# EAGLE schematic blinky-sch-done (EAGLE 7.3.0)
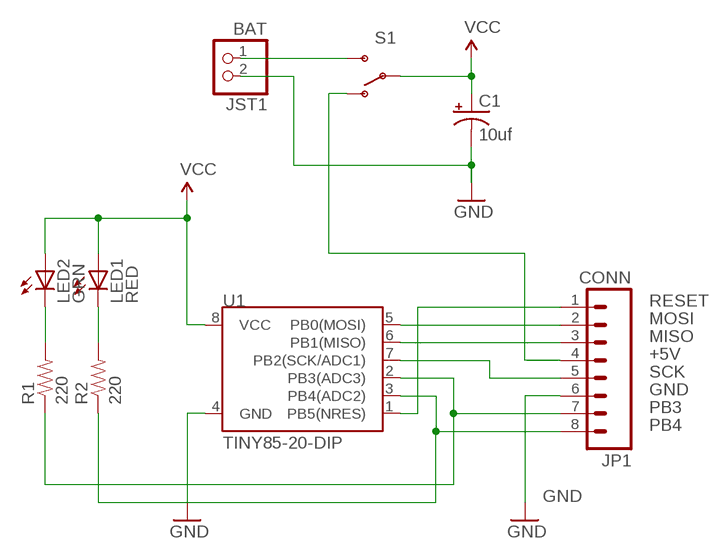
[diagram p0: schematic, sheet 1]

## Parts
C1  10uf  10UF-25V-20%(PTH)  [CPOL-RADIAL-10UF-25V]
JP1  CONN  M08LOCK  [1X08_LOCK]
JST1  BAT  JST_2PIN-THM-RA  [JST-PH-2-THM-RA]
LED1  RED  LED5MM  [LED5MM]
LED2  GRN  LED5MM  [LED5MM]
R1  220  RESISTORAXIAL-0.3  [AXIAL-0.3]
R2  220  RESISTORAXIAL-0.3  [AXIAL-0.3]
S1  SWITCH-SPDT  [SWITCH-SPDT_3.2MM]
U1  TINY85-20-DIP  ATTINY85TINY85-20-DIP  [DIP08]

## Nets
+5V: JP1.4 S1.1(O)
GND: C1.2(-) JP1.6 JST1.2 U1.4(GND)
MISO: JP1.3 U1.6(PB1(MISO))
MOSI: JP1.2 U1.5(PB0(MOSI))
N$1: JST1.1 S1.3(S)
N$4: LED2.K(C) R1.P$2
N$5: LED1.K(C) R2.P$2
PB3: JP1.7 R1.P$1 U1.2(PB3(ADC3))
PB4: JP1.8 R2.P$1 U1.3(PB4(ADC2))
RESET: JP1.1 U1.1(PB5(NRES))
SCK: JP1.5 U1.7(PB2(SCK/ADC1))
VCC: C1.1(+) LED1.A LED2.A S1.2(P) U1.8(VCC)

## Library data of the parts
C1 = NovaEagleCADCLass:10UF-25V-20%(PTH): CAP-08440; PROD_ID: CAP-08440
JP1 = NovaEagleCADCLass:M08: Header 8 Standard 8-pin 0.1" header. Use with straight break away headers (SKU : PRT-00116), right angle break away headers (PRT-00553), swiss pins (PRT-00743), machine pins (PRT-00117), and female headers (PRT-00115).
JST1 = NovaEagleCADCLass:JST_2PIN: JST 2-Pin Connectors of various flavors SMT-RA (S2B-PH-SM4) 4UConnector #17311 SMT (B2B-PH-SM4) THM-RA (S2B-PH) THM (B2B-PH)
LED1 LED2 = NovaEagleCADCLass:LED: LEDs Standard schematic elements and footprints for 5mm, 3mm, 1206, and 0603 sized LEDs. 5mm - Spark Fun Electronics SKU : COM-00529 (and others)
R1 R2 = NovaEagleCADCLass:RESISTOR: Resistor Basic schematic elements and footprints for 0603, 1206, and PTH resistors.
S1 = NovaEagleCADCLass:SWITCH-SPDT: SPDT Switch Simple slide switch, Spark Fun Electronics SKU : COM-00102 DPDT SMT slide switch, AYZ0202, SWCH-08179
U1 = NovaEagleCADCLass:ATTINY85: Atmel 8-pin 2/4/8kB flash uC; PROD_ID: IC-09445